# EAGLE schematic connectors (EAGLE 6.3)
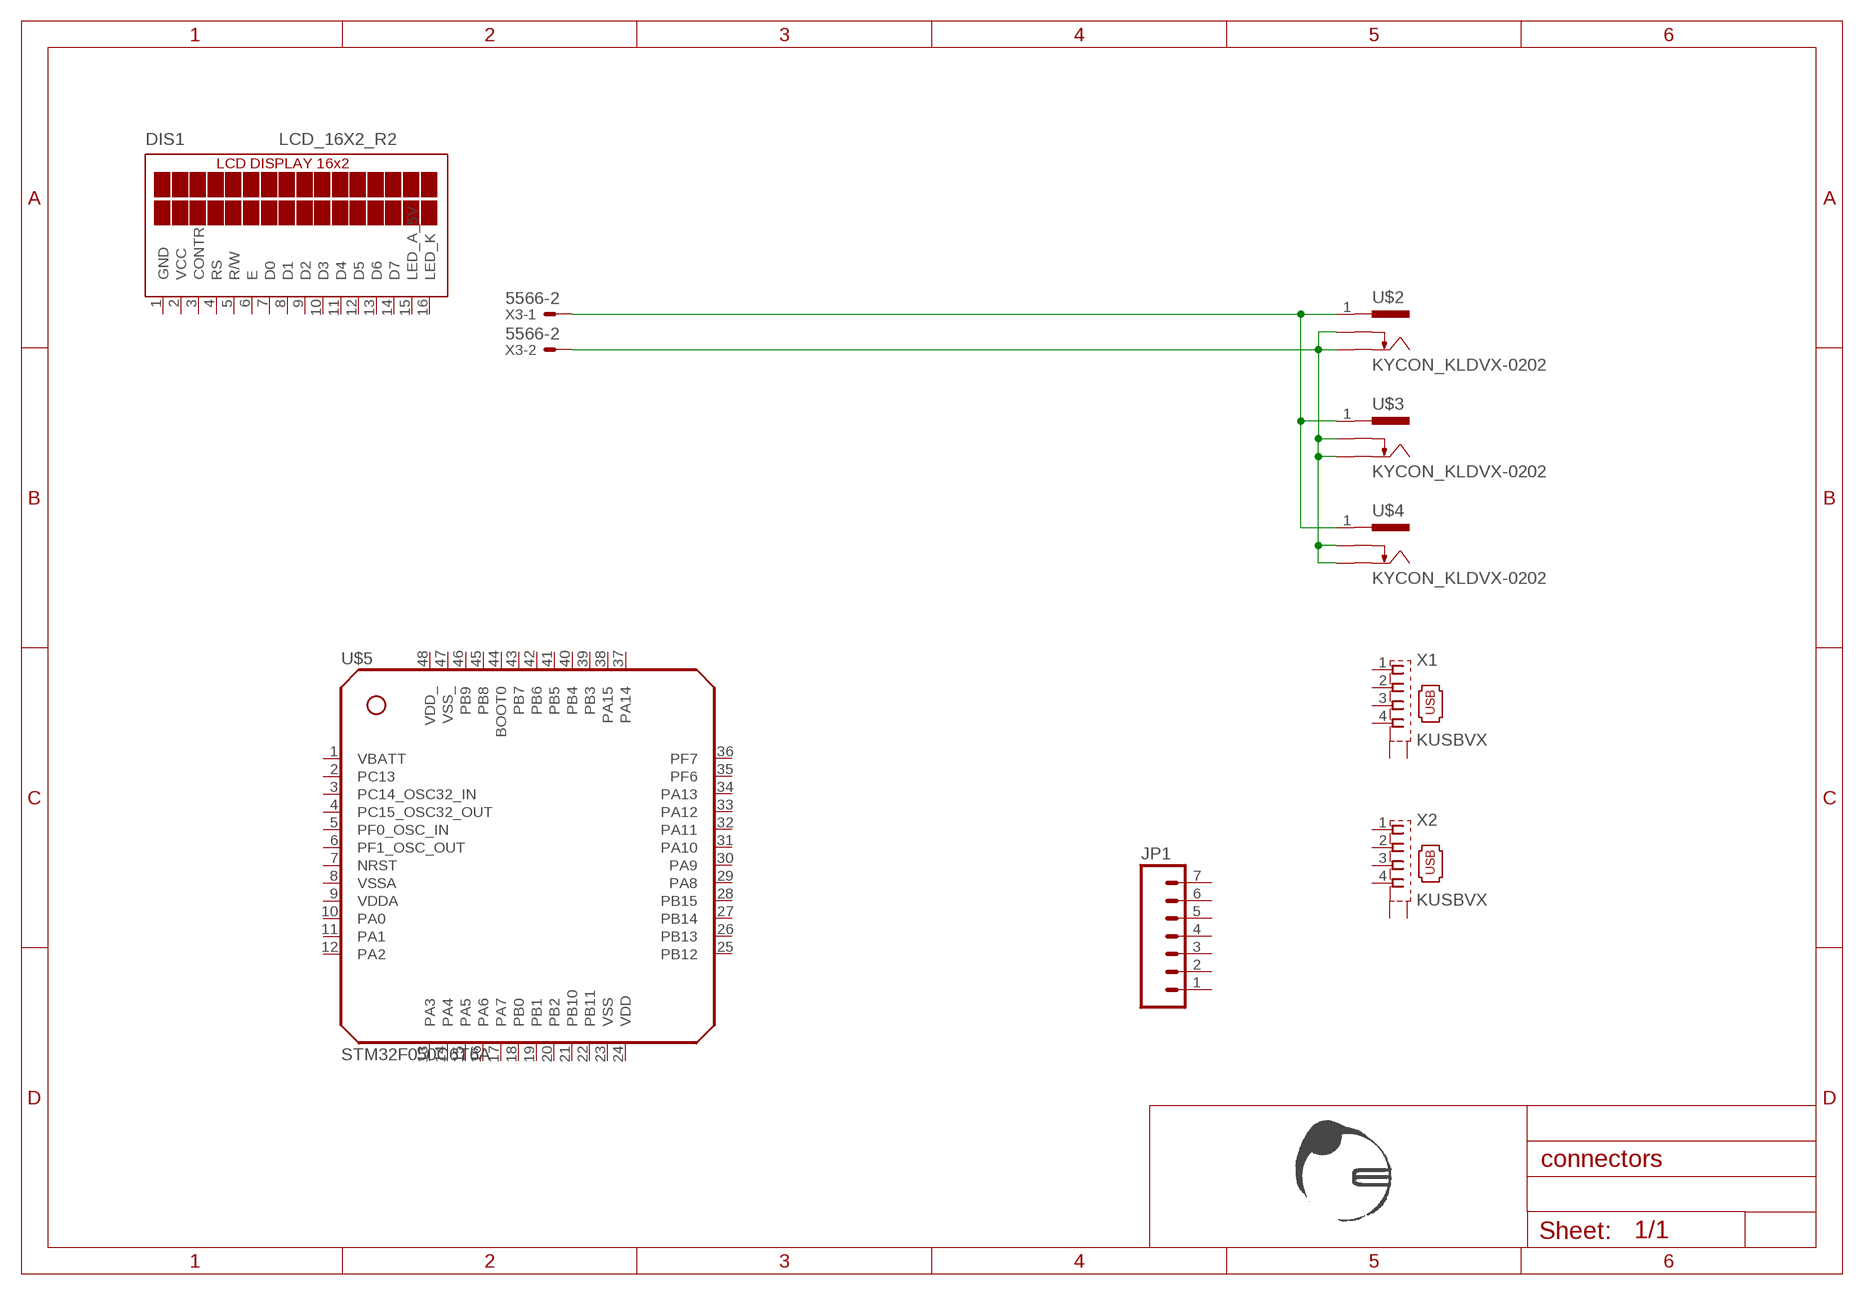
[diagram p0: schematic, sheet 1]

## Parts
DIS1  LCD_16X2_R2  [LCD_16X2_R2]
JP1  M07  [1X07]
U$1  EQUINOX_LOGO_SMALL  [EQUINOX_LOGO_SMALL]
U$2  KYCON_KLDVX-0202  [KYCON_KLVDX_2020_B]
U$3  KYCON_KLDVX-0202  [KYCON_KLVDX_2020_B]
U$4  KYCON_KLDVX-0202  [KYCON_KLVDX_2020_B]
U$5  STM32F050C6T6A  [LQFP48]
X1  KUSBVX  [KUSBVX]
X2  KUSBVX  [KUSBVX]
X3  5566-2  [5566-2]

## Nets
N$1: U$2.1(PAD1) U$3.1(PAD1) U$4.1(PAD1) X3.1
N$2: U$2.2(PAD2) U$2.3(PAD3) U$3.2(PAD2) U$3.3(PAD3) U$4.2(PAD2) U$4.3(PAD3) X3.2
Unconnected: DIS1.3(CONTR) DIS1.4(RS) DIS1.5(R/W) DIS1.6(E) DIS1.7(D0) DIS1.8(D1) DIS1.9(D2) DIS1.10(D3) DIS1.11(D4) DIS1.12(D5) DIS1.13(D6) DIS1.14(D7) DIS1.15(LED_A_5V) DIS1.16(LED_K) JP1.1 JP1.2 JP1.3 JP1.4 JP1.5 JP1.6 JP1.7 U$5.1(VBATT) U$5.2(PC13) U$5.3(PC14_OSC32_IN) U$5.4(PC15_OSC32_OUT) U$5.5(PF0_OSC_IN) U$5.6(PF1_OSC_OUT) U$5.7(NRST) U$5.8(VSSA) U$5.9(VDDA) U$5.10(PA0) U$5.11(PA1) U$5.12(PA2) U$5.13(PA3) U$5.14(PA4) U$5.15(PA5) U$5.16(PA6) U$5.17(PA7) U$5.18(PB0) U$5.19(PB1) U$5.20(PB2) U$5.21(PB10) U$5.22(PB11) U$5.25(PB12) U$5.26(PB13) U$5.27(PB14) U$5.28(PB15) U$5.29(PA8) U$5.30(PA9) U$5.31(PA10) U$5.32(PA11) U$5.33(PA12) U$5.34(PA13) U$5.35(PF6) U$5.36(PF7) U$5.37(PA14) U$5.38(PA15) U$5.39(PB3) U$5.40(PB4) U$5.41(PB5) U$5.42(PB6) U$5.43(PB7) U$5.44(BOOT0) U$5.45(PB8) U$5.46(PB9) X1.1 X1.2 X1.3 X1.4 X1.M1(S1) X1.M2(S2) X2.1 X2.2 X2.3 X2.4 X2.M1(S1) X2.M2(S2)

## Power pins joined to a net without a drawn wire
GND: DIS1.1(GND)
VCC: DIS1.2(VCC)
VDD: U$5.24(VDD)
VDD_: U$5.48(VDD_)
VSS: U$5.23(VSS)
VSS_: U$5.47(VSS_)

## Library data of the parts
DIS1 = equinox:LCD_16X2_R2: Supplier: info <info@huaxinjin.com> Model: 1602C-1; OC_FARNELL: unknown; OC_NEWARK: unknown
JP1 = SparkFun:M07: Header 7 Standard 7-pin 0.1" header. Use with straight break away headers (SKU : PRT-00116), right angle break away headers (PRT-00553), swiss pins (PRT-00743), machine pins (PRT-00117), and female headers (PRT-00115). NOTES ON THE VARIANTS LOCK and LOCK_LONGPADS... This footprint was designed to help hold the alignment of a through-hole component (i.e. 7-pin header) while soldering it into place. You may notice that each hole has been shifted either up or down by 0.005 of an inch from it's more standard position (which is usually a perfectly straight line). This slight alteration caused the pins (the squares in the middle) to touch the edges of the holes. Because they are alternating, it causes a "brace" to hold the header in place. 0.005 has proven to be the perfect amount of "off-center" position when using our standard breakaway headers. Although looks a little odd when you look at the bare footprint, once you have a header in there, the alteration is very hard to notice. Also, if you push a header all the way into place, it is covered up entirely on the bottom side. This idea of altering the position of holes to aid alignment will be further integrated into the Sparkfun Library for other footprints. It can help hold any component with 3 or more connection pins.
U$1 = equinox:EQUINOX_LOGO_SMALL
U$2-U$4 = equinox:KYCON_KLDVX-0202
U$5 = equinox:STM32F050C6T6A
X1 X2 = con-kycon:KUSBVX: Vertical,Top Entry Universal Serial Bus Connector KUSBVX Series Source: KYCON Sibalco USB vertical socket KUSBV.pdf
X3 = con-molex:5566-2: Mini FIT connector 2 pol Source: http://www.molex.com; OC_FARNELL: 1822072; OC_NEWARK: unknown